# Altium project bs.PrjPcb (part 2 of 3)
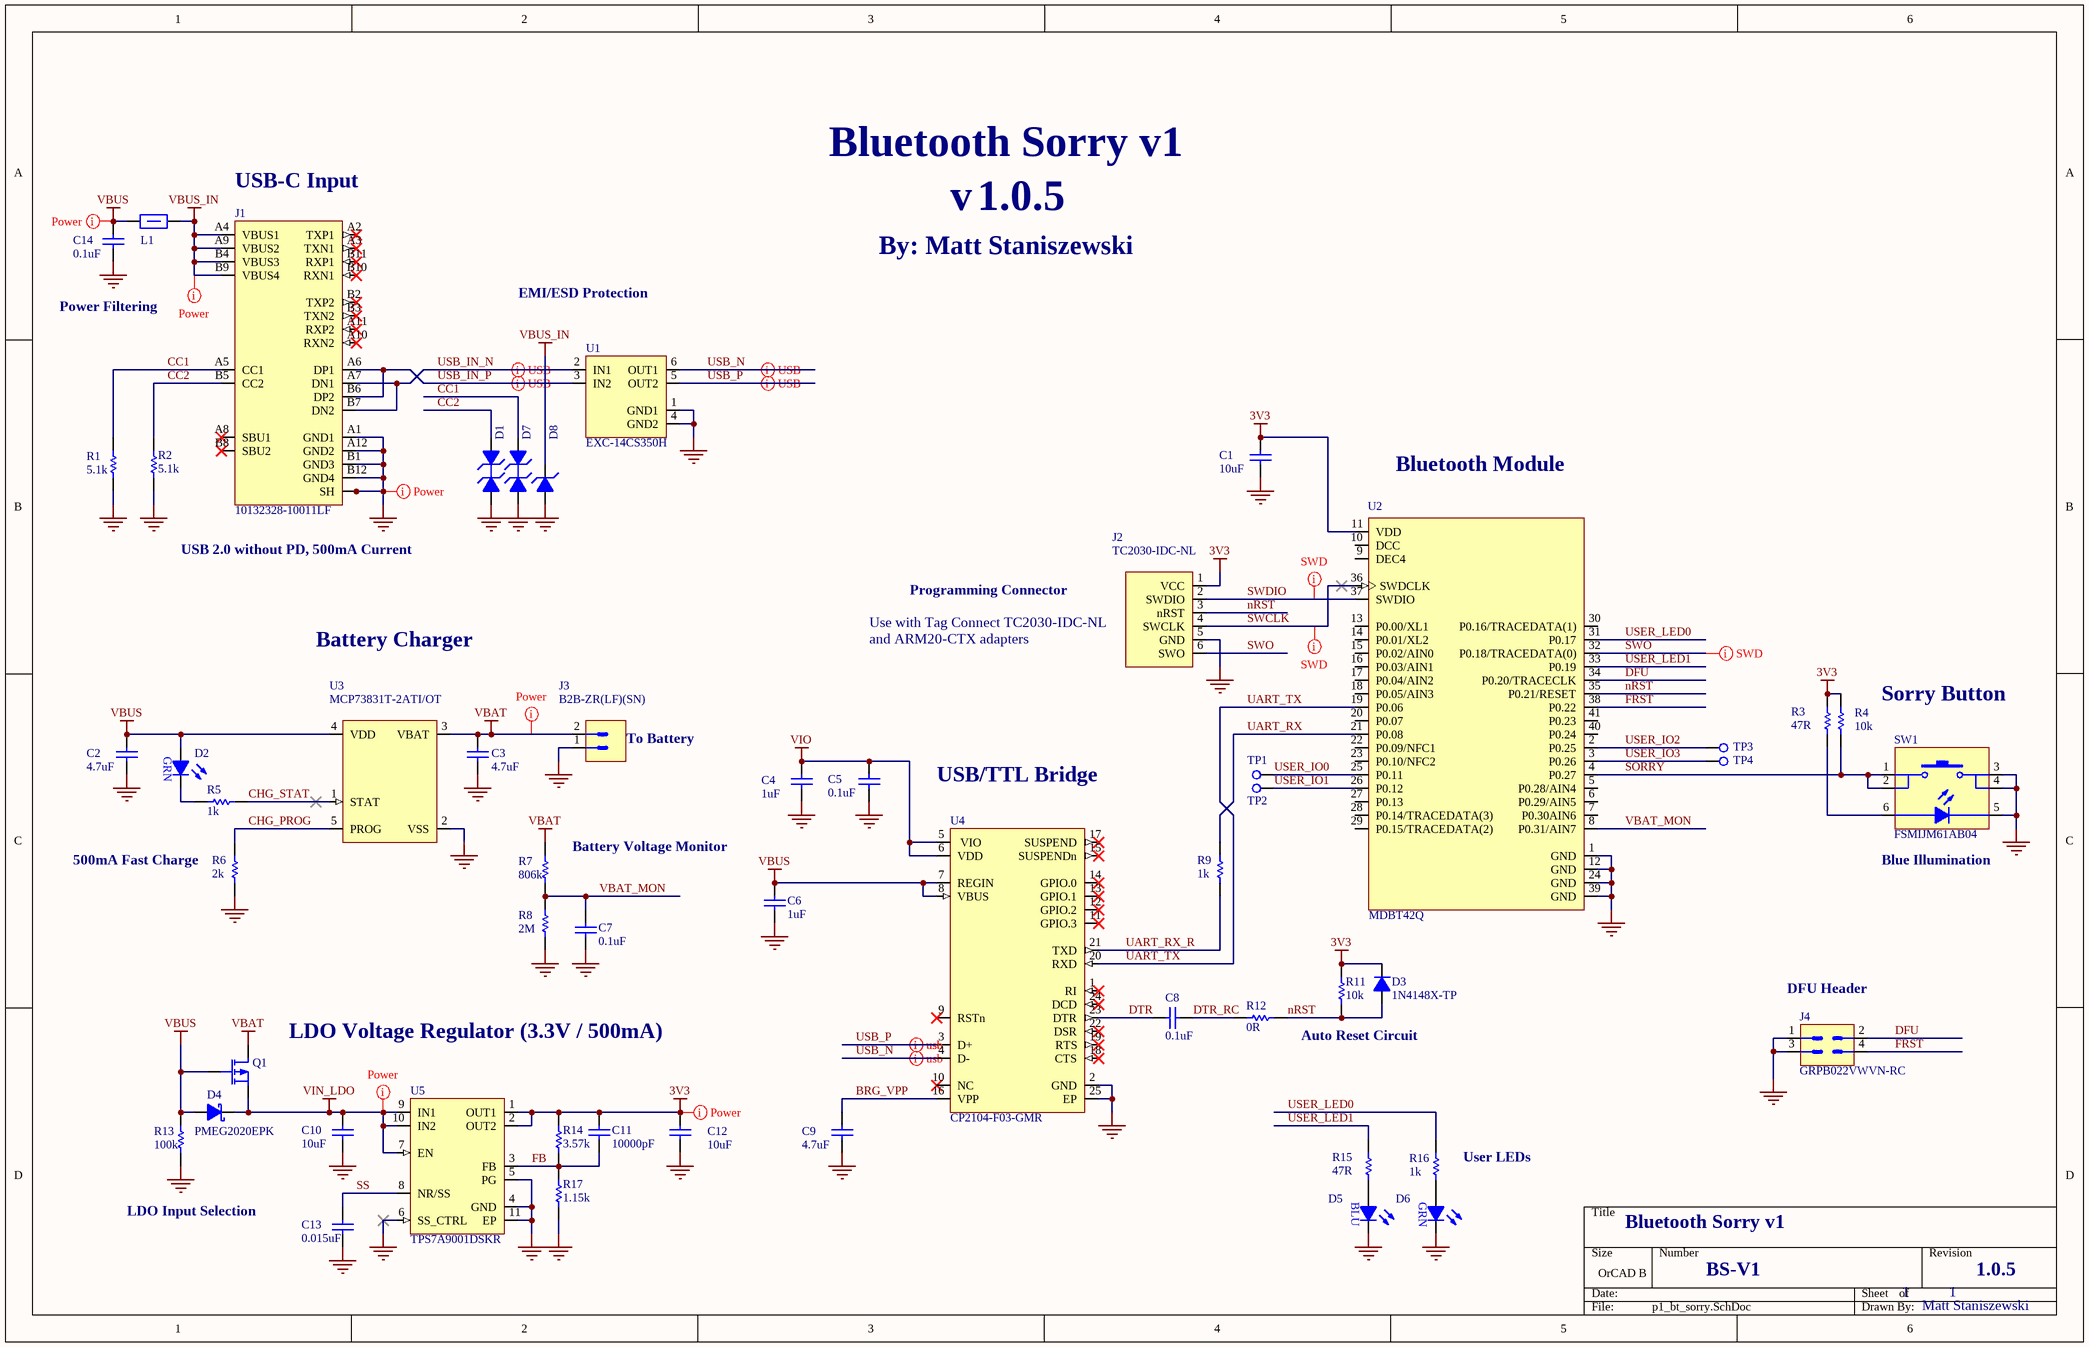
[diagram p1: p1_bt_sorry.SchDoc]

## Sheet p1_bt_sorry.SchDoc (continued)
### Library data of the parts
C1 C10 C12 = 10uF 10V 0402: CAP CER 10UF 10V X5R 0402; Manufacturer: Samsung; Manufacturer Part Number: CL05A106MP5NUNC; Tolerance: 20%; Level: 1; Supplier 1: Digi-Key; Stock 1: 2282441; Pricing 1: 1=0.4, 10=0.277, 100=0.1663, 500=0.1247, 1000=0.1053, 2500=0.0998, 5000=0.0943 (USD); Mount: Surface Mount; Case/Package: 0402; Case Code (Metric): 1005; Case Code (Imperial): 0402; Contact Plating: Nickel,Tin; Min Operating Temperature: -55°C; Max Operating Temperature: 85°C; Package Quantity: 1; Packaging: Tape and Reel; Capacitance: 10uF; Voltage Rating: 10V; Dielectric: X5R; Termination: Wraparound; Length: 1mm; Width: 0.02inch; Thickness: 0.028inch; Depth: 0.5mm; Radiation Hardening: No; Lead Free: Lead Free; ComponentLink1URL: https://datasheet.ciiva.com/25721/cl05a106mp5nunc-25721584.pdf; ComponentLink1Description: https://datasheet.ciiva.com/25721/cl05a106mp5nunc-25721584.pdf; ComponentLink2URL: https://datasheet.ciiva.com/26838/getdatasheetpartid-745310-26838170.pdf; ComponentLink2Description: https://datasheet.ciiva.com/26838/getdatasheetpartid-745310-26838170.pdf; Supplier Part Number 1: 1276-1450-1-ND; ClassName: SMT
C2 C3 C9 = 4.7uF 16V 0402: CAP CER 4.7UF 16V X5R 0402; Manufacturer: Samsung; Manufacturer Part Number: CL05A475MO5NUNC; Tolerance: 20%; Level: 1; Supplier 1: Digi-Key; Stock 1: 282710; Pricing 1: 1=0.36, 10=0.248, 100=0.1485, 500=0.1114, 1000=0.0941, 2500=0.0891, 5000=0.0842 (USD); Case/Package: 0402; Case Code (Metric): 1005; Case Code (Imperial): 0402; Min Operating Temperature: -55°C; Max Operating Temperature: 85°C; Packaging: Tape and Reel; Capacitance: 4.7uF; Voltage Rating: 16V; Dielectric: X5R; Length: 0.039inch; Width: 0.02inch; Thickness: 0.022inch; Supplier Part Number 1: 1276-6836-1-ND; ClassName: SMT
C4 C6 = 1uF 25V 0402: CAP CER 1UF 25V X5R 0402; Manufacturer: Taiyo Yuden; Manufacturer Part Number: TMK105BJ105MV-F; Tolerance: 20%; Level: 1; Supplier 1: Digi-Key; Stock 1: 113342; Pricing 1: 1=0.2, 10=0.14, 100=0.066, 500=0.0463, 1000=0.0383, 2500=0.0357, 5000=0.0326 (USD); Mount: Surface Mount; Case/Package: 0402; Case Code (Metric): 1005; Case Code (Imperial): 0402; Min Operating Temperature: -55°C; Max Operating Temperature: 85°C; Packaging: Tape and Reel; Package Quantity: 1; Voltage Rating (DC): 25V; Dielectric: X5R; Termination: SMD/SMT; Capacitance: 1uF; Voltage Rating: 25V; Composition: Ceramic; Length: 1mm; Height: 0.5mm; Width: 0.02inch; Thickness: 0.022inch; Depth: 0.5mm; Radiation Hardening: No; Halogen Free: Halogen Free; ComponentLink1URL: https://datasheet.ciiva.com/11596/tmk105bj105mv-f-ss-11596466.pdf; ComponentLink1Description: https://datasheet.ciiva.com/11596/tmk105bj105mv-f-ss-11596466.pdf; ComponentLink2URL: https://datasheet.ciiva.com/15922/tmk105bj105mv-f-pdf-15922317.pdf; ComponentLink2Description: https://datasheet.ciiva.com/15922/tmk105bj105mv-f-pdf-15922317.pdf; ComponentLink3URL: https://datasheet.ciiva.com/13404/mlcc-all-e-541559-13404206.pdf; ComponentLink3Description: https://datasheet.ciiva.com/13404/mlcc-all-e-541559-13404206.pdf; ComponentLink4URL: https://datasheet.ciiva.com/30154/128tmk105bj105mv-f-30154639.pdf; ComponentLink4Description: https://datasheet.ciiva.com/30154/128tmk105bj105mv-f-30154639.pdf; Supplier Part Number 1: 587-3245-1-ND; ClassName: SMT
C5 C7 C8 C14 = 0.1uF 16V 0201: CAP CER 0.1UF 16V X5R 0201; Manufacturer: Murata; Manufacturer Part Number: GRM033R61C104ME84D; Capacitance: 1E-07f; Tolerance: 20%; Level: 1; Supplier 1: Digi-Key; Stock 1: 660567; Pricing 1: 1=0.1, 10=0.029, 100=0.013, 500=0.0093, 1000=0.0073, 2500=0.0067, 5000=0.0061 (USD); Case/Package: 0201; Weight: 1.2E-05oz; Case Code (Metric): 0603; Case Code (Imperial): 0201; Min Operating Temperature: -55°C; Max Operating Temperature: 85°C; Packaging: Tape and Reel; Voltage Rating: 16V; Dielectric: X5R; Termination: SMD/SMT; Voltage Rating (DC): 16V; Package Quantity: 15000; Length: 0.024inch; Height: 0.3mm; Width: 0.3mm; Thickness: 0.013inch; ComponentLink1URL: http://www.mouser.com/ds/2/281/c02e-2905.pdf; ComponentLink1Description: http://www.mouser.com/ds/2/281/c02e-2905.pdf; Supplier Part Number 1: 490-9986-1-ND; ClassName: SMT
C11 = 10000pF 25V 0402: CAP CER 10000PF 25V X7R 0402; Manufacturer: Murata; Manufacturer Part Number: GRM155R71E103KA01D; Material: Ceramic; Capacitance: 10nF; Tolerance: 10%; Insulation Resistance: 10GR; Level: 1; ComponentLink1URL: https://datasheet.ciiva.com/11786/0900766b807a1cab-11786320.pdf; ComponentLink1Description: https://datasheet.ciiva.com/11786/0900766b807a1cab-11786320.pdf; ComponentLink2URL: https://datasheet.ciiva.com/18184/getdatasheetpartid-161489-18184689.pdf; ComponentLink2Description: https://datasheet.ciiva.com/18184/getdatasheetpartid-161489-18184689.pdf; ComponentLink3URL: https://datasheet.ciiva.com/28534/1699889-28534148.pdf; ComponentLink3Description: https://datasheet.ciiva.com/28534/1699889-28534148.pdf; ComponentLink4URL: https://datasheet.ciiva.com/7937/1747448-7937621.pdf; ComponentLink4Description: https://datasheet.ciiva.com/7937/1747448-7937621.pdf; ComponentLink5URL: https://datasheet.ciiva.com/16199/product-16199034.pdf; ComponentLink5Description: https://datasheet.ciiva.com/16199/product-16199034.pdf; ComponentLink6URL: https://datasheet.ciiva.com/3777/3813grm155r71e103ka0123-3777115.pdf; ComponentLink6Description: https://datasheet.ciiva.com/3777/3813grm155r71e103ka0123-3777115.pdf; ComponentLink7URL: https://datasheet.ciiva.com/129/partnumbering-e-01-129741.pdf; ComponentLink7Description: https://datasheet.ciiva.com/129/partnumbering-e-01-129741.pdf; ComponentLink8URL: https://datasheet.ciiva.com/129/partnumbering-e-01-129742.pdf; ComponentLink8Description: https://datasheet.ciiva.com/129/partnumbering-e-01-129742.pdf; ComponentLink9URL: https://datasheet.ciiva.com/129/partnumbering-e-01-129743.pdf; ComponentLink9Description: https://datasheet.ciiva.com/129/partnumbering-e-01-129743.pdf; ComponentLink10URL: https://datasheet.ciiva.com/29199/454154-da-01-en-vs-kondensator-0402-29199817.pdf; ComponentLink10Description: https://datasheet.ciiva.com/29199/454154-da-01-en-vs-kondensator-0402-29199817.pdf; Supplier 1: Digi-Key; Stock 1: 4968292; Pricing 1: 1=0.1, 10=0.014, 100=0.0064, 500=0.00456, 1000=0.00358, 2500=0.00325, 5000=0.00299 (USD); Mount: Surface Mount; Case/Package: 0402; Number of Pins: 2; Case Code (Imperial): 0402; Case Code (Metric): 1005; Dielectric Material: Ceramic; Min Operating Temperature: -55°C; Max Operating Temperature: 125°C; Dielectric: X7R; Packaging: Tape and Reel; Voltage Rating: 25V; Voltage Rating (DC): 25V; Package Quantity: 1; Termination: SMD/SMT; Voltage: 25V; Length: 1mm; Height: 0.5mm; Width: 0.5mm; Thickness: 0.022inch; Depth: 0.5mm; Radiation Hardening: No; REACH SVHC: No SVHC; Lead Free: Lead Free; Supplier Part Number 1: 490-1312-1-ND; ClassName: SMT
C13 = 0.015uF 16V 0402: CAP CER 0.015UF 16V X7R 0402; Manufacturer: Murata; Manufacturer Part Number: GRM155R71C153KA01J; Capacitance: 15nF; Tolerance: 10%; Level: 1; Supplier 1: Digi-Key; Stock 1: 43188; Pricing 1: 1=0.1, 10=0.044, 100=0.0197, 500=0.01408, 1000=0.01107, 2500=0.01006, 5000=0.00926 (USD); Mount: Surface Mount; Case/Package: 0402; Case Code (Metric): 1005; Case Code (Imperial): 0402; Min Operating Temperature: -55°C; Max Operating Temperature: 125°C; Package Quantity: 1; Voltage Rating: 16V; Packaging: Tape and Reel; Voltage Rating (DC): 16V; Dielectric: X7R; Termination: SMD/SMT; Length: 1mm; Height: 0.5mm; Width: 0.02inch; Thickness: 0.022inch; Depth: 0.5mm; Radiation Hardening: No; ComponentLink1URL: https://datasheet.ciiva.com/6271/partnumbering-e-01-6271147.pdf; ComponentLink1Description: https://datasheet.ciiva.com/6271/partnumbering-e-01-6271147.pdf; ComponentLink2URL: https://datasheet.ciiva.com/11619/product-11619501.pdf; ComponentLink2Description: https://datasheet.ciiva.com/11619/product-11619501.pdf; ComponentLink3URL: https://datasheet.ciiva.com/6271/partnumbering-e-01-6271151.pdf; ComponentLink3Description: https://datasheet.ciiva.com/6271/partnumbering-e-01-6271151.pdf; Supplier Part Number 1: 490-6329-1-ND; ClassName: SMT
D1 D7 = ESDAXLC6-1BU2: TVS DIODE 3V 17V ST0201; Manufacturer: STMicroelectronics; Direction: Bidirectional; Capacitance: 0.5pF; Number of Bidirectional Channels: 1; Min Breakdown Voltage: 6V; Peak Pulse Power: 40W; Power Line Protection: No; Leakage Current: 70nA; Element Configuration: Single; Peak Pulse Current: 1A; Max Surge Current: 1.3A; ESD Protection: Yes; Test Current: 1mA; ComponentLink1URL: http://www.onsemi.com/; ComponentLink1Description: Manufacturer URL; ComponentLink2URL: http://www.onsemi.cn/pub_link/Collateral/ESD11B-D.PDF; ComponentLink3Description: Package Specification; ComponentLink3URL: http://www.onsemi.com/pub_link/Collateral/152AA.PDF; ComponentLink2Description: Datasheet; ComponentLink4URL: https://datasheet.ciiva.com/6577/esd11b-d-6577814.pdf?src-supplier=Digi-Key; ComponentLink4Description: https://datasheet.ciiva.com/6577/esd11b-d-6577814.pdf?src-supplier=Digi-Key; ComponentLink5URL: https://datasheet.ciiva.com/6577/esd11b-d-6577815.pdf?src-supplier=Digi-Key; ComponentLink5Description: https://datasheet.ciiva.com/6577/esd11b-d-6577815.pdf?src-supplier=Digi-Key; ComponentLink6URL: https://datasheet.ciiva.com/11193/esd11b-d-11193656.pdf?src-supplier=Avnet; ComponentLink6Description: https://datasheet.ciiva.com/11193/esd11b-d-11193656.pdf?src-supplier=Avnet; ComponentLink7URL: https://datasheet.ciiva.com/4510/esd11b-d-4510297.pdf?src-supplier=Mouser; ComponentLink7Description: https://datasheet.ciiva.com/4510/esd11b-d-4510297.pdf?src-supplier=Mouser; Supplier 1: Digi-Key; Manufacturer Part Number: ESDAXLC6-1BU2; Stock 1: 25159; Pricing 1: 1 = 0.42000, 10 = 0.31900, 100 = 0.19890, 500 = 0.13610, 1000 = 0.10469 (USD); RoHS: Yes; Mount: Surface Mount; Case/Package: 0201; Number of Pins: 2; Case Code (Metric): 0603; Case Code (Imperial): 0201; Min Operating Temperature: -40°C; Max Operating Temperature: 150°C; Packaging: Tape and Reel; Package Quantity: 1; Reverse Standoff Voltage: 3V; Clamping Voltage: 17V; Number of Channels: 1; Polarity: Bidirectional; Breakdown Voltage: 6V; Termination: SMD/SMT; Composition: Zener; Max Reverse Leakage Current: 70nA; Length: 0.6mm; Height: 0.33mm; Depth: 0.3mm; Width: 0.35mm; Radiation Hardening: No; Lead Free: Lead Free; ComponentLink8URL: https://datasheet.ciiva.com/24017/dm00065800-24017847.pdf?src-supplier=Avnet; ComponentLink8Description: https://datasheet.ciiva.com/24017/dm00065800-24017847.pdf?src-supplier=Avnet; ComponentLink9URL: https://datasheet.ciiva.com/24017/dm00065800-24017847.pdf?src-supplier=Mouser; ComponentLink9Description: https://datasheet.ciiva.com/24017/dm00065800-24017847.pdf?src-supplier=Mouser; ComponentLink10URL: https://datasheet.ciiva.com/41443/001183999-da-01-en-tvs-diode-3v-1-esdaxlc6-1bu2-st-0201-stm-41443438.pdf?src-supplier=Conrad; ComponentLink10Description: https://datasheet.ciiva.com/41443/001183999-da-01-en-tvs-diode-3v-1-esdaxlc6-1bu2-st-0201-stm-41443438.pdf?src-supplier=Conrad; Supplier Part Number 1: 497-13414-1-ND; ClassName: SMT; Level: 1
D2 D6 = Green 0603 LED: LED GREEN CLEAR 0603 SMD; Manufacturer: Dialight; Manufacturer Part Number: 598-8070-107F; Wavelength: 570nm; Luminous Intensity: 20mcd; Viewing Angle: 140°; Forward Voltage: 2V; Lens Style: Clear,Diffused,Colorless,Rectangular; Forward Current: 20mA; Dominant Wavelength: 568nm; Number of Elements: 1; Power Dissipation: 60mW; Supplier 1: Digi-Key; Stock 1: 147636; Pricing 1: 1=0.45, 10=0.327, 25=0.2504, 100=0.1634, 250=0.1198, 500=0.1016, 1000=0.0835 (USD); Mount: Surface Mount; Case/Package: 0603; Number of Pins: 2; Colour: Green; Case Code (Metric): 1608; Case Code (Imperial): 0603; Lens Colour: Clear; Min Operating Temperature: -30°C; Max Operating Temperature: 100°C; Packaging: Tape and Reel; Package Quantity: 4000; Illumination Colour: Green; Test Current: 20mA; Number of LEDs: 1; Length: 1.6mm; Height: 0.7mm; Width: 0.8mm; Depth: 0.8mm; Radiation Hardening: No; REACH SVHC: No SVHC; Lead Free: Lead Free; ComponentLink1URL: https://datasheet.ciiva.com/4688/598-selectorguide-18902-4688880.pdf; ComponentLink1Description: https://datasheet.ciiva.com/4688/598-selectorguide-18902-4688880.pdf; ComponentLink2URL: https://datasheet.ciiva.com/11774/0900766b80ae2975-11774257.pdf; ComponentLink2Description: https://datasheet.ciiva.com/11774/0900766b80ae2975-11774257.pdf; ComponentLink3URL: https://datasheet.ciiva.com/1243/1484480-1243893.pdf; ComponentLink3Description: https://datasheet.ciiva.com/1243/1484480-1243893.pdf; ComponentLink4URL: https://datasheet.ciiva.com/2110/598-series-0603-pkg-2110165.pdf; ComponentLink4Description: https://datasheet.ciiva.com/2110/598-series-0603-pkg-2110165.pdf; ComponentLink5URL: https://datasheet.ciiva.com/1243/1484480-1243894.pdf; ComponentLink5Description: https://datasheet.ciiva.com/1243/1484480-1243894.pdf; ComponentLink6URL: https://datasheet.ciiva.com/2110/598-series-0603-pkg-2110166.pdf; ComponentLink6Description: https://datasheet.ciiva.com/2110/598-series-0603-pkg-2110166.pdf; ComponentLink7URL: https://datasheet.ciiva.com/2110/598-series-0603-pkg-2110167.pdf; ComponentLink7Description: https://datasheet.ciiva.com/2110/598-series-0603-pkg-2110167.pdf; ComponentLink8URL: https://datasheet.ciiva.com/14605/70081990-14605530.pdf; ComponentLink8Description: https://datasheet.ciiva.com/14605/70081990-14605530.pdf; ComponentLink9URL: https://datasheet.ciiva.com/15965/mdei5980603-15965419.pdf; ComponentLink9Description: https://datasheet.ciiva.com/15965/mdei5980603-15965419.pdf; ComponentLink10URL: https://datasheet.ciiva.com/30188/mdei5980603-30188139.pdf; ComponentLink10Description: https://datasheet.ciiva.com/30188/mdei5980603-30188139.pdf; ComponentLink11URL: https://datasheet.ciiva.com/15117/getdatasheetpartid-146438-15117836.pdf; ComponentLink11Description: https://datasheet.ciiva.com/15117/getdatasheetpartid-146438-15117836.pdf; ComponentLink12URL: https://datasheet.ciiva.com/22749/1484480-22749228.pdf; ComponentLink12Description: https://datasheet.ciiva.com/22749/1484480-22749228.pdf; ComponentLink13URL: https://datasheet.ciiva.com/16400/smt-selector-guide-16400463.pdf; ComponentLink13Description: https://datasheet.ciiva.com/16400/smt-selector-guide-16400463.pdf; Supplier Part Number 1: 350-2035-1-ND; ClassName: SMT; Level: 1
D3 = 1N4148X-TP: DIODE GEN PURP 75V 150MA SOD523; Manufacturer: MCC; Max Surge Current: 2A; Recovery Time: 4ns; Forward Voltage: 1.25V; Forward Current: 300mA; Max Reverse Leakage Current: 1uA; Power Dissipation: 200mW; Max Repetitive Reverse Voltage (Vrrm): 100V; Element Configuration: Single; Polarity: Standard; Capacitance: 2pF; Level: 1; Supplier 1: Digi-Key; Manufacturer Part Number: 1N4148X-TP; Stock 1: 2150607; Pricing 1: 1 = 0.14000, 10 = 0.12500, 100 = 0.08150, 500 = 0.03986, 1000 = 0.02718 (USD); RoHS: Yes; Mount: Surface Mount; Number of Pins: 2; Min Operating Temperature: -65°C; Max Operating Temperature: 150°C; Package Quantity: 1; Packaging: Tape and Reel; Average Rectified Current: 150mA; Reverse Recovery Time: 4ns; Peak Non-Repetitive Surge Current: 2A; Voltage Rating (DC): 75V; Current Rating: 150mA; Output Current: 300mA; Max Reverse Voltage (DC): 75V; Radiation Hardening: No; Lead Free: Lead Free; ComponentLink1URL: https://datasheet.ciiva.com/4435/1n4148xsod-523-358-4435190.pdf?src-supplier=Mouser; ComponentLink1Description: https://datasheet.ciiva.com/4435/1n4148xsod-523-358-4435190.pdf?src-supplier=Mouser; ComponentLink2URL: https://datasheet.ciiva.com/911/1n4148xsod-523-911686.pdf?src-supplier=Digi-Key; ComponentLink2Description: https://datasheet.ciiva.com/911/1n4148xsod-523-911686.pdf?src-supplier=Digi-Key; ComponentLink3URL: https://datasheet.ciiva.com/911/1n4148xsod-523-911687.pdf?src-supplier=Digi-Key; ComponentLink3Description: https://datasheet.ciiva.com/911/1n4148xsod-523-911687.pdf?src-supplier=Digi-Key; ComponentLink4URL: https://datasheet.ciiva.com/911/1n4148xsod-523-911688.pdf?src-supplier=Digi-Key; ComponentLink4Description: https://datasheet.ciiva.com/911/1n4148xsod-523-911688.pdf?src-supplier=Digi-Key; ComponentLink5URL: https://datasheet.ciiva.com/16836/1n4148xsod-523-16836299.pdf?src-supplier=Future+Electronics; ComponentLink5Description: https://datasheet.ciiva.com/16836/1n4148xsod-523-16836299.pdf?src-supplier=Future+Electronics; Supplier Part Number 1: 1N4148XTPMSCT-ND; ClassName: SMT
D4 = PMEG2020EPK,315: DIODE SCHOTTKY 20V 2A 2DFN; Manufacturer: NXP Semiconductors; Max Power Dissipation: 1.565W; Peak Reverse Current: 70uA; Reverse Recovery Time: 5ns; Natural Thermal Resistance: 20°C/W; Forward Voltage: 395mV; Max Forward Surge Current (Ifsm): 5A; Element Configuration: Single; Level: 1; Supplier 1: Digi-Key; Manufacturer Part Number: PMEG2020EPK,315; Stock 1: 146420; Pricing 1: 1=0.51, 10=0.387, 100=0.2411, 500=0.165, 1000=0.1269 (USD); Mount: Surface Mount; Case/Package: SMD/SMT; Number of Pins: 2; Min Operating Temperature: -55°C; Max Operating Temperature: 150°C; Package Quantity: 8000; Packaging: Tape and Reel; Forward Current: 2A; Reverse Voltage (DC): 20V; Average Rectified Current: 2A; Max Repetitive Reverse Voltage (Vrrm): 20V; Peak Non-Repetitive Surge Current: 5A; Radiation Hardening: No; ComponentLink1URL: https://datasheet.ciiva.com/29592/pmeg2020epk-29592900.pdf; ComponentLink1Description: https://datasheet.ciiva.com/29592/pmeg2020epk-29592900.pdf; ComponentLink2URL: https://datasheet.ciiva.com/29592/pmeg2020epk-29592901.pdf; ComponentLink2Description: https://datasheet.ciiva.com/29592/pmeg2020epk-29592901.pdf; ComponentLink3URL: https://datasheet.ciiva.com/24111/pmeg2020epk-268880-24111063.pdf; ComponentLink3Description: https://datasheet.ciiva.com/24111/pmeg2020epk-268880-24111063.pdf; ComponentLink4URL: https://datasheet.ciiva.com/25648/pmeg2020epk-25648600.pdf; ComponentLink4Description: https://datasheet.ciiva.com/25648/pmeg2020epk-25648600.pdf; Supplier Part Number 1: 1727-1338-1-ND; ClassName: SMT
D5 = Blue 0603 LED: LED BLUE CLEAR 0603 SMD; Manufacturer: Dialight; Manufacturer Part Number: 598-8091-107F; Lens Colour: Clear,Colorless; Wavelength: 475nm; Luminous Intensity: 140mcd; Viewing Angle: 140°; Forward Voltage: 3.2V; Lens Style: Clear,Diffused,Colorless,Rectangular; Forward Current: 20mA; Dominant Wavelength: 470nm; Number of Elements: 1; Power Dissipation: 70mW; Supplier 1: Digi-Key; Stock 1: 42042; Pricing 1: 1=0.75, 10=0.583, 25=0.4864, 100=0.4189, 250=0.374, 500=0.3216, 1000=0.2483 (USD); Mount: Surface Mount; Case/Package: 0603; Number of Pins: 2; Colour: Blue; Case Code (Metric): 1608; Case Code (Imperial): 0603; Min Operating Temperature: -30°C; Max Operating Temperature: 100°C; Packaging: Tape and Reel; Package Quantity: 4000; Illumination Colour: Blue; Lens Transparency: Clear; Test Current: 20mA; Number of LEDs: 1; Length: 1.6mm; Height: 0.7mm; Width: 0.8mm; Depth: 0.8mm; Radiation Hardening: No; REACH SVHC: No SVHC; Lead Free: Lead Free; ComponentLink1URL: https://datasheet.ciiva.com/15118/getdatasheetpartid-194139-15118048.pdf; ComponentLink1Description: https://datasheet.ciiva.com/15118/getdatasheetpartid-194139-15118048.pdf; ComponentLink2URL: https://datasheet.ciiva.com/2111/598-series-0603-pkg-2111556.pdf; ComponentLink2Description: https://datasheet.ciiva.com/2111/598-series-0603-pkg-2111556.pdf; ComponentLink3URL: https://datasheet.ciiva.com/2111/598-series-0603-pkg-2111557.pdf; ComponentLink3Description: https://datasheet.ciiva.com/2111/598-series-0603-pkg-2111557.pdf; ComponentLink4URL: https://datasheet.ciiva.com/15965/mdei5980603-15965445.pdf; ComponentLink4Description: https://datasheet.ciiva.com/15965/mdei5980603-15965445.pdf; ComponentLink5URL: https://datasheet.ciiva.com/30240/mdei5980603-30240533.pdf; ComponentLink5Description: https://datasheet.ciiva.com/30240/mdei5980603-30240533.pdf; ComponentLink6URL: https://datasheet.ciiva.com/2111/598-series-0603-pkg-2111558.pdf; ComponentLink6Description: https://datasheet.ciiva.com/2111/598-series-0603-pkg-2111558.pdf; ComponentLink7URL: https://datasheet.ciiva.com/7970/25658-7970182.pdf; ComponentLink7Description: https://datasheet.ciiva.com/7970/25658-7970182.pdf; ComponentLink8URL: https://datasheet.ciiva.com/14603/70081992-14603963.pdf; ComponentLink8Description: https://datasheet.ciiva.com/14603/70081992-14603963.pdf; ComponentLink9URL: https://datasheet.ciiva.com/16400/smt-selector-guide-16400478.pdf; ComponentLink9Description: https://datasheet.ciiva.com/16400/smt-selector-guide-16400478.pdf; Supplier Part Number 1: 350-2037-1-ND; ClassName: SMT; Level: 1
D8 = ESDA7P60-1U1M: TVS DIODE 5V 11.6V 1610; Manufacturer: STMicroelectronics; Number of Unidirectional Channels: 1; Min Breakdown Voltage: 6.4V; Peak Pulse Power: 700W; Power Line Protection: No; Polarity: Unidirectional; Max Breakdown Voltage: 7.2V; Peak Pulse Current: 60A; Supplier 1: Digi-Key; Manufacturer Part Number: ESDA7P60-1U1M; Stock 1: 12135; Pricing 1: 1 = 0.47000, 10 = 0.38100, 100 = 0.25960, 500 = 0.19468, 1000 = 0.14600 (USD); RoHS: Yes; Mount: Surface Mount; Case/Package: 1610; Number of Pins: 2; Min Operating Temperature: -55°C; Max Operating Temperature: 150°C; Packaging: Cut Tape; Reverse Standoff Voltage: 5V; Clamping Voltage: 11.6V; Composition: Zener; REACH SVHC: No SVHC; ComponentLink1URL: http://www.farnell.com/datasheets/2041290.pdf?src-supplier=Farnell; ComponentLink1Description: http://www.farnell.com/datasheets/2041290.pdf?src-supplier=Farnell; ComponentLink2URL: http://www.st.com/content/ccc/resource/technical/document/datasheet/44/e9/26/44/42/ee/4f/e5/DM00139972.pdf/files/DM00139972.pdf/jcr:content/translations/en.DM00139972.pdf?src-supplier=Digi-Key; ComponentLink2Description: http://www.st.com/content/ccc/resource/technical/document/datasheet/44/e9/26/44/42/ee/4f/e5/DM00139972.pdf/files/DM00139972.pdf/jcr:content/translations/en.DM00139972.pdf?src-supplier=Digi-Key; ComponentLink3URL: http://www.farnell.com/datasheets/2041290.pdf?src-supplier=Element14; ComponentLink3Description: http://www.farnell.com/datasheets/2041290.pdf?src-supplier=Element14; Supplier Part Number 1: 497-16253-1-ND; ClassName: SMT; Level: 1
J1 = USB-C Vertical: CONN RCPT USB3.1 TYPEC 24POS SMD; Manufacturer: Amphenol FCI; Level: 1; Supplier 1: Digi-Key; Manufacturer Part Number: 10132328-10011LF; Stock 1: 6832; Pricing 1: 1 = 2.67000, 10 = 2.41900, 25 = 2.27120, 50 = 2.17240, 100 = 2.07370 (USD); RoHS: No; ComponentLink1URL: http://www.amphenol-icc.com/media/wysiwyg/files/drawing/10132328.pdf?src-supplier=Digi-Key; ComponentLink1Description: http://www.amphenol-icc.com/media/wysiwyg/files/drawing/10132328.pdf?src-supplier=Digi-Key; Supplier Part Number 1: 609-5380-1-ND; ClassName: PTH,Sensitive Exception
J2 = Tag Connect 6-Pin SWD: TAG CONNECT 6PIN SWD; Level: 1; ClassName: SMT,Sensitive Exception; Manufacturer: Tag Connect; Manufacturer Part Number: TC2030-IDC-NL; Supplier 1: N/A; Supplier Part Number 1: N/A
J3 = JST ZH 2-Pin PTH Vertical: CONN HEADER ZH TOP 2POS 1.5MM; Manufacturer: JST; Body Plating: Tin; Number of Positions: 2; Connector Type: Male Pin; Current Rating: 1A; Contact Resistance: 30mR; Max Voltage Rating (AC): 50V; Gender: Male; Insulation Resistance: 500MR; Panel Thickness: 3.5mm; Level: 1; ComponentLink1URL: https://datasheet.ciiva.com/26894/getdatasheetpartid-643133-26894438.pdf?src-supplier=Verical; ComponentLink1Description: https://datasheet.ciiva.com/26894/getdatasheetpartid-643133-26894438.pdf?src-supplier=Verical; ComponentLink2URL: https://datasheet.ciiva.com/11752/0900766b8082f580-11752167.pdf?src-supplier=RSComponents; ComponentLink2Description: https://datasheet.ciiva.com/11752/0900766b8082f580-11752167.pdf?src-supplier=RSComponents; ComponentLink3URL: https://datasheet.ciiva.com/25616/0900766b81147f94-25616906.pdf?src-supplier=RSComponents; ComponentLink3Description: https://datasheet.ciiva.com/25616/0900766b81147f94-25616906.pdf?src-supplier=RSComponents; ComponentLink4URL: https://datasheet.ciiva.com/8052/80551-8052026.pdf?src-supplier=Element14; ComponentLink4Description: https://datasheet.ciiva.com/8052/80551-8052026.pdf?src-supplier=Element14; ComponentLink5URL: https://datasheet.ciiva.com/712/ezh-712443.pdf?src-supplier=Digi-Key; ComponentLink5Description: https://datasheet.ciiva.com/712/ezh-712443.pdf?src-supplier=Digi-Key; Supplier 1: Digi-Key; Manufacturer Part Number: B2B-ZR(LF)(SN); Stock 1: 123534; Pricing 1: 1 = 0.17000, 10 = 0.16200, 100 = 0.09990, 500 = 0.08270, 1000 = 0.07237, 5000 = 0.06203, 10000 = 0.06031 (USD); RoHS: Yes; Mount: Through Hole; Contact Plating: Tin; Color: Natural; Contact Material: Brass; Housing Color: Beige; Housing Material: Polyamide; Material: Nylon; Min Operating Temperature: -25°C; Max Operating Temperature: 85°C; Number of Rows: 1; Packaging: Bulk; Termination: Solder; Max Current Rating: 1A; Fastening Type: Detent; Number of Contacts: 2; Orientation: Straight; Voltage Rating: 50V; Voltage Rating (AC): 50V; Voltage Rating (DC): 50V; Length: 4.5mm; Pitch: 1.5mm; Depth: 3.5mm; Lead Pitch: 1.5mm; Contact Mating Length: 0.094inch; Lead Free: Lead Free; REACH SVHC: No SVHC; Flammability Rating: UL94 V-0; Supplier Part Number 1: 455-1657-ND; ClassName: PTH
J4 = 4-Pin 2x2 0.05in Header: CONN HEADER VERT 4POS 1.27MM; Manufacturer: Sullins; Number of Positions: 4; Connector Type: Male Pin; Pitch: 0.05inch; Level: 1; Supplier 1: Digi-Key; Manufacturer Part Number: GRPB022VWVN-RC; Stock 1: 1339; Pricing 1: 1 = 0.37000, 10 = 0.35000, 100 = 0.24480, 500 = 0.20980, 1000 = 0.17483, 5000 = 0.14985, 10000 = 0.14430 (USD); RoHS: Yes; Mount: Through Hole; Contact Plating: Gold; Package Quantity: 1; Number of Rows: 2; Packaging: Bulk; Termination: Solder; Row Spacing: 0.05inch; Contact Mating Length: 0.118inch; ComponentLink1URL: https://datasheet.ciiva.com/726/grpb-2vwvn-rc10954-c-726662.pdf?src-supplier=Digi-Key; ComponentLink1Description: https://datasheet.ciiva.com/726/grpb-2vwvn-rc10954-c-726662.pdf?src-supplier=Digi-Key; Supplier Part Number 1: S9015E-02-ND; ClassName: PTH
L1 = BLM15PX601SN1D: FERRITE BEAD 600 OHM 0402 1LN; Manufacturer: Murata; Material: Steel; Impedance: 600R; Tolerance: 25%; Current Rating: 900mA; Number of Lines: 1; DC Resistance (DCR): 230mR; Test Frequency: 100MHz; Supplier 1: Digi-Key; Manufacturer Part Number: BLM15PX601SN1D; Stock 1: 156023; Pricing 1: 1=0.15, 10=0.123, 25=0.0956, 50=0.0792, 100=0.0682, 250=0.0546, 500=0.0491, 1000=0.0409, 5000=0.0382 (USD); Case/Package: 0402; Number of Pins: 2; Case Code (Metric): 1005; Case Code (Imperial): 0402; Min Operating Temperature: -55°C; Max Operating Temperature: 125°C; Package Quantity: 10000; Packaging: Tape and Reel; Max Current Rating: 900mA; Max DC Current: 900mA; Termination: SMD/SMT; Number of Circuits: 1; Length: 1mm; Height: 0.5mm; Width: 0.5mm; Lead Free: Lead Free; ComponentLink1URL: https://datasheet.ciiva.com/41860/l0110e-41860698.pdf; ComponentLink1Description: https://datasheet.ciiva.com/41860/l0110e-41860698.pdf; ComponentLink2URL: https://datasheet.ciiva.com/41449/001172217-da-01-en-drossel-0402-600r-1-0x0-5mm-10000st-41449505.pdf; ComponentLink2Description: https://datasheet.ciiva.com/41449/001172217-da-01-en-drossel-0402-600r-1-0x0-5mm-10000st-41449505.pdf; Supplier Part Number 1: 490-9657-1-ND; ClassName: SMT; Level: 1
Q1 = DMP21D0UFB4-7B: MOSFET P-CH 20V 770MA 3DFN; Manufacturer: Diodes; Max Power Dissipation: 990mW; Number of Elements: 1; Input Capacitance: 80pF; Rise Time: 8ns; Rds On Max: 495mR; Continuous Drain Current (ID): 1.17A; Drain to Source Resistance: 960mR; Gate to Source Voltage (Vgs): 8V; Fall Time: 18.5ns; Turn-Off Delay Time: 31.7ns; Turn-On Delay Time: 7.1ns; Element Configuration: Single; Drain to Source Breakdown Voltage: -20V; Supplier 1: Digi-Key; Manufacturer Part Number: DMP21D0UFB4-7B; Stock 1: 167177; Pricing 1: 1=0.4, 10=0.303, 100=0.1886, 500=0.129, 1000=0.0992 (USD); Mount: Surface Mount; Case/Package: DFN; Number of Pins: 3; Contact Plating: Gold; Min Operating Temperature: -55°C; Max Operating Temperature: 150°C; Packaging: Tape and Reel; Package Quantity: 1; Drain to Source Voltage (Vdss): 20V; Number of Channels: 1; Power Dissipation: 990mW; Length: 1.05mm; Height: 0.35mm; Width: 0.65mm; Radiation Hardening: No; Lead Free: Lead Free; REACH SVHC: No SVHC; ComponentLink1URL: https://datasheet.ciiva.com/6369/dmp21d0ufb4-6369012.pdf; ComponentLink1Description: https://datasheet.ciiva.com/6369/dmp21d0ufb4-6369012.pdf; ComponentLink2URL: https://datasheet.ciiva.com/6369/dmp21d0ufb4-6369014.pdf; ComponentLink2Description: https://datasheet.ciiva.com/6369/dmp21d0ufb4-6369014.pdf; ComponentLink3URL: https://datasheet.ciiva.com/6369/dmp21d0ufb4-6369015.pdf; ComponentLink3Description: https://datasheet.ciiva.com/6369/dmp21d0ufb4-6369015.pdf; ComponentLink4URL: https://datasheet.ciiva.com/30023/dmp21d0ufb4-30023815.pdf; ComponentLink4Description: https://datasheet.ciiva.com/30023/dmp21d0ufb4-30023815.pdf; ComponentLink5URL: https://datasheet.ciiva.com/30479/0900766b8115c367-30479913.pdf; ComponentLink5Description: https://datasheet.ciiva.com/30479/0900766b8115c367-30479913.pdf; ComponentLink6URL: https://datasheet.ciiva.com/13051/dmp21d0ufb4-13051690.pdf; ComponentLink6Description: https://datasheet.ciiva.com/13051/dmp21d0ufb4-13051690.pdf; Supplier Part Number 1: DMP21D0UFB4-7BDICT-ND; ClassName: SMT; Level: 1
R1 R2 = 5.1k 0402: RES SMD 5.1K OHM 1% 1/16W 0402; Manufacturer: Yageo; Manufacturer Part Number: RC0402FR-075K1L; Power Rating: 63mW; Voltage Rating: 50V; Resistance: 5.1kR; Temperature Coefficient: 100ppm/°C; Level: 1; Supplier 1: Digi-Key; Stock 1: 3990797; Pricing 1: 1 = 0.10000, 10 = 0.01600, 100 = 0.00670, 1000 = 0.00301, 2500 = 0.00261, 5000 = 0.00215 (USD); RoHS: Yes; Case/Package: 0402; Case Code (Metric): 1005; Case Code (Imperial): 0402; Min Operating Temperature: -55°C; Max Operating Temperature: 155°C; Tolerance: 1%; Packaging: Tape and Reel; Package Quantity: 1; Composition: Thick Film; Number of Terminations: 2; Termination: SMD/SMT; Military Standard: Not; Max Power Dissipation: 63mW; Voltage Rating (DC): 50V; Working Voltage: 50V; Features: Moisture Resistant; Length: 1mm; Height: 0.016inch; Width: 0.02inch; Depth: 0.5mm; REACH SVHC: Unknown; Lead Free: Lead Free; ComponentLink1URL: https://datasheet.ciiva.com/15189/getdatasheetpartid-323636-15189493.pdf?src-supplier=Verical; ComponentLink1Description: https://datasheet.ciiva.com/15189/getdatasheetpartid-323636-15189493.pdf?src-supplier=Verical; ComponentLink2URL: https://datasheet.ciiva.com/2453/pyu-r-int-thick-7-2453400.pdf?src-supplier=Digi-Key; ComponentLink2Description: https://datasheet.ciiva.com/2453/pyu-r-int-thick-7-2453400.pdf?src-supplier=Digi-Key; ComponentLink3URL: https://datasheet.ciiva.com/46394/1018594-46394936.pdf?src-supplier=Element14; ComponentLink3Description: https://datasheet.ciiva.com/46394/1018594-46394936.pdf?src-supplier=Element14; ComponentLink4URL: https://datasheet.ciiva.com/2453/pyu-r-int-thick-7-2453401.pdf?src-supplier=Digi-Key; ComponentLink4Description: https://datasheet.ciiva.com/2453/pyu-r-int-thick-7-2453401.pdf?src-supplier=Digi-Key; ComponentLink5URL: https://datasheet.ciiva.com/2453/pyu-r-int-thick-7-2453402.pdf?src-supplier=Digi-Key; ComponentLink5Description: https://datasheet.ciiva.com/2453/pyu-r-int-thick-7-2453402.pdf?src-supplier=Digi-Key; ComponentLink6URL: https://datasheet.ciiva.com/16744/pyu-rc0402-51-rohs-l-6-r-16744283.pdf?src-supplier=Future+Electronics; ComponentLink6Description: https://datasheet.ciiva.com/16744/pyu-rc0402-51-rohs-l-6-r-16744283.pdf?src-supplier=Future+Electronics; ComponentLink7URL: https://datasheet.ciiva.com/12558/pyu-rc0402-51-rohs-l-6-r-8721-12558460.pdf?src-supplier=Mouser; ComponentLink7Description: https://datasheet.ciiva.com/12558/pyu-rc0402-51-rohs-l-6-r-8721-12558460.pdf?src-supplier=Mouser; ComponentLink8URL: https://datasheet.ciiva.com/7983/1018594-7983519.pdf?src-supplier=Element14; ComponentLink8Description: https://datasheet.ciiva.com/7983/1018594-7983519.pdf?src-supplier=Element14; Supplier Part Number 1: 311-5.10KLRCT-ND; ClassName: SMT
R3 R15 = 47R 0402: RES SMD 47 OHM 1% 1/16W 0402; Manufacturer: Yageo; Manufacturer Part Number: RC0402FR-0747RL; Temperature Coefficient: 100ppm/°C; Power Rating: 63mW; Voltage Rating: 50V; Level: 1; Supplier 1: Digi-Key; Stock 1: 2791305; Pricing 1: 1 = 0.10000, 10 = 0.01600, 100 = 0.00670, 1000 = 0.00301, 2500 = 0.00261, 5000 = 0.00215 (USD); RoHS: Yes; Case/Package: 0402; Weight: 2.3E-05oz; Case Code (Metric): 1005; Case Code (Imperial): 0402; Min Operating Temperature: -55°C; Max Operating Temperature: 155°C; Resistance: 47R; Tolerance: 1%; Composition: Thick Film; Packaging: Tape and Reel; Package Quantity: 1; Number of Terminations: 2; Termination: SMD/SMT; Military Standard: Not; Max Power Dissipation: 63mW; Features: Moisture Resistant; Length: 1mm; Height: 0.016inch; Width: 0.02inch; Depth: 0.5mm; REACH SVHC: Unknown; Lead Free: Lead Free; ComponentLink1URL: https://datasheet.ciiva.com/11819/0900766b80c66297-11819509.pdf?src-supplier=RSComponents; ComponentLink1Description: https://datasheet.ciiva.com/11819/0900766b80c66297-11819509.pdf?src-supplier=RSComponents; ComponentLink2URL: https://datasheet.ciiva.com/2553/pyu-r-int-thick-7-2553221.pdf?src-supplier=Digi-Key; ComponentLink2Description: https://datasheet.ciiva.com/2553/pyu-r-int-thick-7-2553221.pdf?src-supplier=Digi-Key; ComponentLink3URL: https://datasheet.ciiva.com/2553/pyu-r-int-thick-7-2553222.pdf?src-supplier=Digi-Key; ComponentLink3Description: https://datasheet.ciiva.com/2553/pyu-r-int-thick-7-2553222.pdf?src-supplier=Digi-Key; ComponentLink4URL: https://datasheet.ciiva.com/2553/pyu-r-int-thick-7-2553223.pdf?src-supplier=Digi-Key; ComponentLink4Description: https://datasheet.ciiva.com/2553/pyu-r-int-thick-7-2553223.pdf?src-supplier=Digi-Key; ComponentLink5URL: https://datasheet.ciiva.com/12577/pyu-rc0402-51-rohs-l-6-r-12577592.pdf?src-supplier=Mouser; ComponentLink5Description: https://datasheet.ciiva.com/12577/pyu-rc0402-51-rohs-l-6-r-12577592.pdf?src-supplier=Mouser; ComponentLink6URL: https://datasheet.ciiva.com/15189/getdatasheetpartid-329266-15189467.pdf?src-supplier=Verical; ComponentLink6Description: https://datasheet.ciiva.com/15189/getdatasheetpartid-329266-15189467.pdf?src-supplier=Verical; ComponentLink7URL: https://datasheet.ciiva.com/17067/pyu-rc0402-51-rohs-l-6-r-17067470.pdf?src-supplier=Future+Electronics; ComponentLink7Description: https://datasheet.ciiva.com/17067/pyu-rc0402-51-rohs-l-6-r-17067470.pdf?src-supplier=Future+Electronics; Supplier Part Number 1: 311-47.0LRCT-ND; ClassName: SMT
R4 R11 = 10k 0402: RES SMD 10K OHM 1% 1/16W 0402; Manufacturer: Yageo Phycomp; Manufacturer Part Number: RC0402FR-0710KL; Temperature Coefficient: 100ppm/°C; Resistance: 10000R; Voltage Rating (DC): 50V; Power Rating: 63mW; Level: 1; Supplier 1: Digi-Key; Stock 1: 98435877; Pricing 1: 1 = 0.10000, 10 = 0.01600, 100 = 0.00670, 1000 = 0.00301, 2500 = 0.00261, 5000 = 0.00215 (USD); RoHS: Yes; Mount: Surface Mount; Case/Package: 0402; Number of Pins: 2; Min Operating Temperature: -55°C; Max Operating Temperature: 155°C; Tolerance: 1%; Packaging: Cut Tape; Length: 1mm; Height: 0.32mm; Width: 500um; Depth: 0.5mm; REACH SVHC: No SVHC; Lead Free: Lead Free; ComponentLink1URL: http://www.farnell.com/datasheets/2167052.pdf?src-supplier=Farnell; ComponentLink1Description: http://www.farnell.com/datasheets/2167052.pdf?src-supplier=Farnell; ComponentLink2URL: http://www.yageo.com/documents/recent/PYu-RC_Group_51_RoHS_L_10.pdf?src-supplier=Digi-Key; ComponentLink2Description: http://www.yageo.com/documents/recent/PYu-RC_Group_51_RoHS_L_10.pdf?src-supplier=Digi-Key; ComponentLink3URL: http://www.farnell.com/datasheets/1738692.pdf?src-supplier=Element14; ComponentLink3Description: http://www.farnell.com/datasheets/1738692.pdf?src-supplier=Element14; ComponentLink4URL: http://www.farnell.com/datasheets/2167052.pdf?src-supplier=Newark; ComponentLink4Description: http://www.farnell.com/datasheets/2167052.pdf?src-supplier=Newark; ComponentLink5URL: http://www.farnell.com/datasheets/2167052.pdf?src-supplier=Element14; ComponentLink5Description: http://www.farnell.com/datasheets/2167052.pdf?src-supplier=Element14; ComponentLink6URL: http://www.farnell.com/datasheets/1784430.pdf?src-supplier=Element14; ComponentLink6Description: http://www.farnell.com/datasheets/1784430.pdf?src-supplier=Element14; ComponentLink7URL: http://documents.rs-components.com/techlib://itc_doclist_GB.htm?stockno=6185832&src-supplier=RSComponents; ComponentLink7Description: http://documents.rs-components.com/techlib://itc_doclist_GB.htm?stockno=6185832&src-supplier=RSComponents; Supplier Part Number 1: 311-10.0KLRCT-ND; ClassName: SMT
R5 R9 R16 = 1k 0402: RES SMD 1K OHM 1% 1/16W 0402; Manufacturer: Yageo; Manufacturer Part Number: RC0402FR-071KL; Resistance: 1kR; Temperature Coefficient: 100ppm/°C; Voltage Rating (DC): 50V; Power Rating: 62.5mW; Level: 1; Supplier 1: Digi-Key; Stock 1: 72757571; Pricing 1: 1 = 0.10000, 10 = 0.01600, 100 = 0.00670, 1000 = 0.00301, 2500 = 0.00261, 5000 = 0.00215 (USD); RoHS: Yes; Case/Package: 0402; Number of Pins: 2; Case Code (Imperial): 0402; Case Code (Metric): 1005; Min Operating Temperature: -55°C; Max Operating Temperature: 155°C; Composition: Thick Film; Tolerance: 1%; Packaging: Tape and Reel; Voltage Rating: 50V; Termination: SMD/SMT; Military Standard: Not; Length: 1mm; Height: 0.32mm; Width: 0.5mm; Depth: 0.5mm; REACH SVHC: Unknown; Lead Free: Lead Free; ComponentLink1URL: https://datasheet.ciiva.com/11819/0900766b80c66297-11819477.pdf?src-supplier=RSComponents; ComponentLink1Description: https://datasheet.ciiva.com/11819/0900766b80c66297-11819477.pdf?src-supplier=RSComponents; ComponentLink2URL: https://datasheet.ciiva.com/12666/pyu-rc0402-51-rohs-l-6-r-12666741.pdf?src-supplier=Mouser; ComponentLink2Description: https://datasheet.ciiva.com/12666/pyu-rc0402-51-rohs-l-6-r-12666741.pdf?src-supplier=Mouser; ComponentLink3URL: https://datasheet.ciiva.com/17063/pyu-rc0402-51-rohs-l-6-r-17063193.pdf?src-supplier=Future+Electronics; ComponentLink3Description: https://datasheet.ciiva.com/17063/pyu-rc0402-51-rohs-l-6-r-17063193.pdf?src-supplier=Future+Electronics; ComponentLink4URL: https://datasheet.ciiva.com/22747/1018594-22747513.pdf?src-supplier=Element14; ComponentLink4Description: https://datasheet.ciiva.com/22747/1018594-22747513.pdf?src-supplier=Element14; ComponentLink5URL: https://datasheet.ciiva.com/7849/1018594-7849869.pdf?src-supplier=Element14; ComponentLink5Description: https://datasheet.ciiva.com/7849/1018594-7849869.pdf?src-supplier=Element14; ComponentLink6URL: https://datasheet.ciiva.com/7983/1018594-7983502.pdf?src-supplier=Element14; ComponentLink6Description: https://datasheet.ciiva.com/7983/1018594-7983502.pdf?src-supplier=Element14; ComponentLink7URL: https://datasheet.ciiva.com/7849/1018594-7849871.pdf?src-supplier=Element14; ComponentLink7Description: https://datasheet.ciiva.com/7849/1018594-7849871.pdf?src-supplier=Element14; Supplier Part Number 1: 311-1.00KLRCT-ND; ClassName: SMT
R6 = 2k 0402: RES SMD 2K OHM 1% 1/16W 0402; Manufacturer: Yageo; Manufacturer Part Number: RC0402FR-072KL; Resistance: 2kR; Power Rating: 63mW; Voltage Rating: 50V; Temperature Coefficient: 100ppm/°C; Level: 1; Supplier 1: Digi-Key; Stock 1: 13397188; Pricing 1: 1 = 0.10000, 10 = 0.01600, 100 = 0.00670, 1000 = 0.00301, 2500 = 0.00261, 5000 = 0.00215 (USD); RoHS: Yes; Case/Package: 0402; Case Code (Metric): 1005; Case Code (Imperial): 0402; Min Operating Temperature: -55°C; Max Operating Temperature: 155°C; Composition: Thick Film; Tolerance: 1%; Package Quantity: 1; Packaging: Tape and Reel; Number of Terminations: 2; Termination: SMD/SMT; Military Standard: Not; Max Power Dissipation: 63mW; Voltage Rating (DC): 50V; Working Voltage: 50V; Features: Moisture Resistant; Length: 1mm; Height: 0.016inch; Width: 0.02inch; Depth: 0.5mm; REACH SVHC: Unknown; Lead Free: Lead Free; ComponentLink1URL: https://datasheet.ciiva.com/11808/0900766b80c66297-11808787.pdf?src-supplier=RSComponents; ComponentLink1Description: https://datasheet.ciiva.com/11808/0900766b80c66297-11808787.pdf?src-supplier=RSComponents; ComponentLink2URL: https://datasheet.ciiva.com/2453/pyu-r-int-thick-7-2453634.pdf?src-supplier=Digi-Key; ComponentLink2Description: https://datasheet.ciiva.com/2453/pyu-r-int-thick-7-2453634.pdf?src-supplier=Digi-Key; ComponentLink3URL: https://datasheet.ciiva.com/2453/pyu-r-int-thick-7-2453635.pdf?src-supplier=Digi-Key; ComponentLink3Description: https://datasheet.ciiva.com/2453/pyu-r-int-thick-7-2453635.pdf?src-supplier=Digi-Key; ComponentLink4URL: https://datasheet.ciiva.com/2453/pyu-r-int-thick-7-2453636.pdf?src-supplier=Digi-Key; ComponentLink4Description: https://datasheet.ciiva.com/2453/pyu-r-int-thick-7-2453636.pdf?src-supplier=Digi-Key; ComponentLink5URL: https://datasheet.ciiva.com/15189/getdatasheetpartid-358921-15189414.pdf?src-supplier=Verical; ComponentLink5Description: https://datasheet.ciiva.com/15189/getdatasheetpartid-358921-15189414.pdf?src-supplier=Verical; ComponentLink6URL: https://datasheet.ciiva.com/12667/pyu-rc0402-51-rohs-l-6-r-12667451.pdf?src-supplier=Mouser; ComponentLink6Description: https://datasheet.ciiva.com/12667/pyu-rc0402-51-rohs-l-6-r-12667451.pdf?src-supplier=Mouser; ComponentLink7URL: https://datasheet.ciiva.com/7983/1018594-7983517.pdf?src-supplier=Element14; ComponentLink7Description: https://datasheet.ciiva.com/7983/1018594-7983517.pdf?src-supplier=Element14; ComponentLink8URL: https://datasheet.ciiva.com/7849/1018594-7849934.pdf?src-supplier=Element14; ComponentLink8Description: https://datasheet.ciiva.com/7849/1018594-7849934.pdf?src-supplier=Element14; ComponentLink9URL: https://datasheet.ciiva.com/7849/1018594-7849935.pdf?src-supplier=Element14; ComponentLink9Description: https://datasheet.ciiva.com/7849/1018594-7849935.pdf?src-supplier=Element14; Supplier Part Number 1: 311-2KLRCT-ND; ClassName: SMT
R7 = 806k 0402: RES SMD 806K OHM 1% 1/10W 0402; Manufacturer: Panasonic; Manufacturer Part Number: ERJ-2RKF8063X; Resistance: 806kR; Power Rating: 100mW; Voltage Rating: 50V; Temperature Coefficient: 100ppm/°C; Level: 1; Supplier 1: Digi-Key; Stock 1: 231213; Pricing 1: 1 = 0.10000, 10 = 0.04500, 100 = 0.01830, 1000 = 0.00823, 2500 = 0.00715, 5000 = 0.00590 (USD); RoHS: Yes; Mount: Surface Mount; Case/Package: 0402; Case Code (Metric): 1005; Case Code (Imperial): 0402; Contact Plating: Tin; Min Operating Temperature: -55°C; Max Operating Temperature: 155°C; Tolerance: 1%; Packaging: Tape and Reel; Package Quantity: 10000; Composition: Thick Film; Number of Terminations: 2; Termination: SMD/SMT; Military Standard: Not; Max Power Dissipation: 100mW; Voltage Rating (DC): 50V; Features: Automotive AEC-Q200; Length: 1mm; Height: 0.35mm; Width: 0.02inch; Depth: 0.5mm; REACH SVHC: No SVHC; ComponentLink1URL: https://datasheet.ciiva.com/16785/70260748-16785671.pdf?src-supplier=Allied+Electronics; ComponentLink1Description: https://datasheet.ciiva.com/16785/70260748-16785671.pdf?src-supplier=Allied+Electronics; ComponentLink2URL: https://datasheet.ciiva.com/24026/aoa0000ce2-24026935.pdf?src-supplier=Mouser; ComponentLink2Description: https://datasheet.ciiva.com/24026/aoa0000ce2-24026935.pdf?src-supplier=Mouser; ComponentLink3URL: https://datasheet.ciiva.com/9179/aoa0000ce2-9179930.pdf?src-supplier=Avnet; ComponentLink3Description: https://datasheet.ciiva.com/9179/aoa0000ce2-9179930.pdf?src-supplier=Avnet; ComponentLink4URL: https://datasheet.ciiva.com/22668/1678782-22668410.pdf?src-supplier=Element14; ComponentLink4Description: https://datasheet.ciiva.com/22668/1678782-22668410.pdf?src-supplier=Element14; ComponentLink5URL: https://datasheet.ciiva.com/16759/70260748-16759515.pdf?src-supplier=Allied+Electronics; ComponentLink5Description: https://datasheet.ciiva.com/16759/70260748-16759515.pdf?src-supplier=Allied+Electronics; ComponentLink6URL: https://datasheet.ciiva.com/7753/1678782-7753996.pdf?src-supplier=Element14; ComponentLink6Description: https://datasheet.ciiva.com/7753/1678782-7753996.pdf?src-supplier=Element14; ComponentLink7URL: https://datasheet.ciiva.com/9179/aoa0000ce2-9179932.pdf?src-supplier=Avnet; ComponentLink7Description: https://datasheet.ciiva.com/9179/aoa0000ce2-9179932.pdf?src-supplier=Avnet; Supplier Part Number 1: P806KLCT-ND; ClassName: SMT
R8 = 2M 0402: RES SMD 2M OHM 1% 1/16W 0402; Manufacturer: Samsung; Manufacturer Part Number: RC1005F205CS; Resistance: 2MR; Max Power Dissipation: 63mW; Temperature Coefficient: 100ppm/°C; Voltage Rating (DC): 50V; Level: 1; Supplier 1: Digi-Key; Stock 1: 975529; Pricing 1: 1 = 0.10000, 10 = 0.02000, 100 = 0.00830, 1000 = 0.00373, 2500 = 0.00324, 5000 = 0.00267 (USD); RoHS: Yes; Case/Package: 0402; Case Code (Metric): 1005; Case Code (Imperial): 0402; Contact Plating: Tin; Min Operating Temperature: -55°C; Max Operating Temperature: 155°C; Packaging: Tape and Reel; Tolerance: 1%; Composition: Thick Film; Number of Terminations: 2; Features: Moisture Resistant; Length: 0.039inch; Height: 0.016inch; Width: 0.02inch; Radiation Hardening: No; Lead Free: Lead Free; ComponentLink1URL: https://datasheet.ciiva.com/26159/chip-resistor-150112-1-26159468.pdf?src-supplier=Digi-Key; ComponentLink1Description: https://datasheet.ciiva.com/26159/chip-resistor-150112-1-26159468.pdf?src-supplier=Digi-Key; ComponentLink2URL: https://datasheet.ciiva.com/26159/chip-resistor-150112-1-26159486.pdf?src-supplier=Digi-Key; ComponentLink2Description: https://datasheet.ciiva.com/26159/chip-resistor-150112-1-26159486.pdf?src-supplier=Digi-Key; Supplier Part Number 1: 1276-4293-1-ND; ClassName: SMT
R12 = 0R 0402: RES SMD 0 OHM JUMPER 1/16W 0402; Manufacturer: Yageo; Manufacturer Part Number: RC0402FR-070RL; Resistance: 0mR; Tolerance: 1%; Power Rating: 62.5mW; Voltage Rating: 50V; Temperature Coefficient: 200ppm/°C; Level: 1; Supplier 1: Digi-Key; Stock 1: 12597172; Pricing 1: 1 = 0.10000, 10 = 0.01400, 25 = 0.01000, 50 = 0.00780, 100 = 0.00570, 250 = 0.00436, 500 = 0.00348, 1000 = 0.00257, 5000 = 0.00184 (USD); RoHS: Yes; Mount: Surface Mount; Case/Package: 0402; Contact Plating: Tin; Case Code (Imperial): 0402; Case Code (Metric): 1005; Min Operating Temperature: -55°C; Max Operating Temperature: 155°C; Composition: Thick Film; Packaging: Tape and Reel; Termination: SMD/SMT; Length: 1mm; Height: 0.35mm; Width: 0.5mm; Radiation Hardening: No; Lead Free: Lead Free; ComponentLink1URL: https://datasheet.ciiva.com/8896/pyu-rc0402-51-rohs-l-6-8896149.pdf?src-supplier=Avnet; ComponentLink1Description: https://datasheet.ciiva.com/8896/pyu-rc0402-51-rohs-l-6-8896149.pdf?src-supplier=Avnet; ComponentLink2URL: https://datasheet.ciiva.com/16790/pyu-rc0402-51-rohs-l-6-r-16790444.pdf?src-supplier=Future+Electronics; ComponentLink2Description: https://datasheet.ciiva.com/16790/pyu-rc0402-51-rohs-l-6-r-16790444.pdf?src-supplier=Future+Electronics; ComponentLink3URL: https://datasheet.ciiva.com/28419/pyu-rc0402-51-rohs-l-6-28419661.pdf?src-supplier=Avnet+Europe; ComponentLink3Description: https://datasheet.ciiva.com/28419/pyu-rc0402-51-rohs-l-6-28419661.pdf?src-supplier=Avnet+Europe; ComponentLink4URL: https://datasheet.ciiva.com/16869/pyu-rc0402-51-rohs-l-6-16869518.pdf?src-supplier=Avnet+Europe; ComponentLink4Description: https://datasheet.ciiva.com/16869/pyu-rc0402-51-rohs-l-6-16869518.pdf?src-supplier=Avnet+Europe; Supplier Part Number 1: 311-0.0LRCT-ND; ClassName: SMT